# EasyEDA Pro project AcGun-1.0.eprj

# Schematic Schematic1
Create Date: 2023-02-09; Page Name: P1; Project Name: AcGun-1.0; Schematic Name: Schematic1; Update Date: 2023-06-06
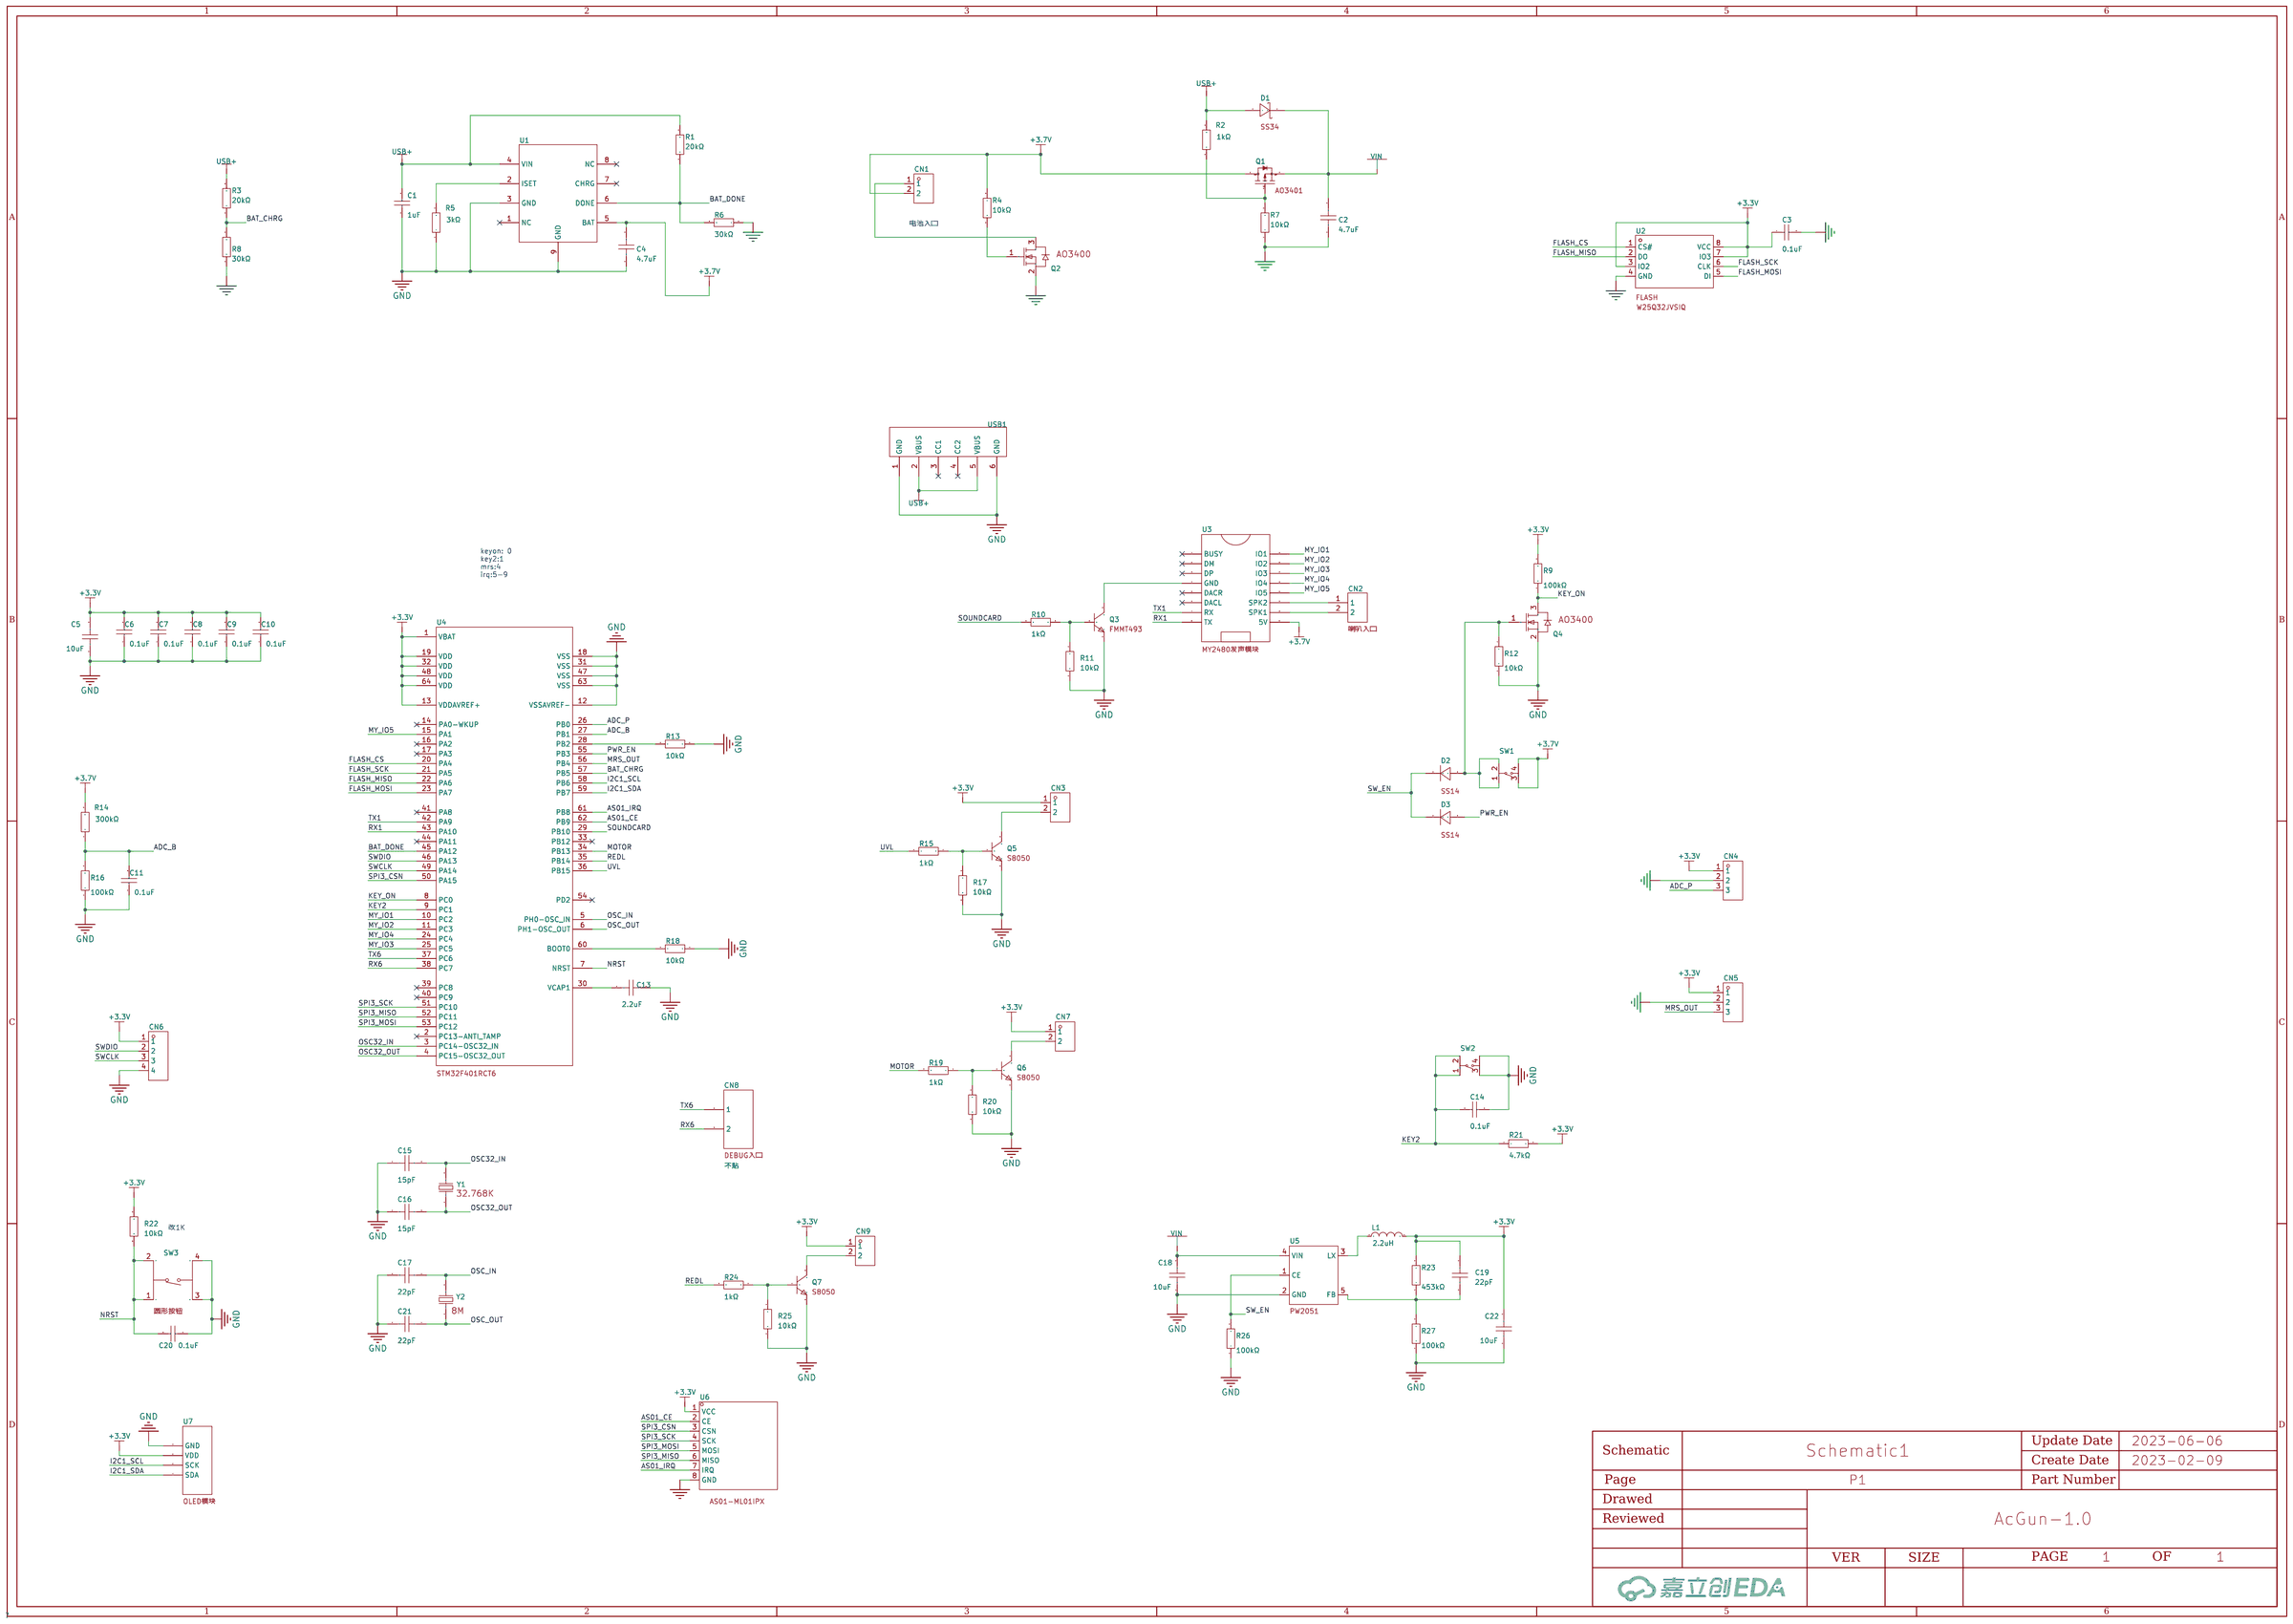
[diagram p0: schematic sheet]

## Parts
C1  1uF  [C0603]
C2  4.7uF  [C0603]
C3  0.1uF  [C0603]
C4  4.7uF  [C0603]
C5  10uF  [C0603]
C6  0.1uF  [C0603]
C7  0.1uF  [C0603]
C8  0.1uF  [C0603]
C9  0.1uF  [C0603]
C10  0.1uF  [C0603]
C11  0.1uF  [C0603]
C13  2.2uF  [C0603]
C14  0.1uF  [C0603]
C15  15pF  [C0603]
C16  15pF  [C0603]
C17  22pF  [C0603]
C18  10uF  [C0603]
C19  22pF  [C0603]
C20  0.1uF  [C0603]
C21  22pF  [C0603]
C22  10uF  [C0603]
CN1  HDGC2501WR-2P  [CONN-TH_2P-P2.50_HDGC2501WR-2P]
CN2  -  [2P接线点]
CN3  HDGC2001WR-2P  [CONN-TH_2P-P2.00_HDGC2001WR-2P]
CN4  HDGC1501WR-3P  [CONN-TH_3P-P1.50_HDGC1501WR-3P]
CN5  HDGC1501WR-3P  [CONN-TH_3P-P1.50_HDGC1501WR-3P]
CN6  1125-1104G0R138C002  [HDR-TH_4P-P2.54-H-M-W9.4]
CN7  HDGC2001WR-2P  [CONN-TH_2P-P2.00_HDGC2001WR-2P]
CN8  不贴  [XH2.54插件2P]  (no BOM)
CN9  HDGC2001WR-2P  [CONN-TH_2P-P2.00_HDGC2001WR-2P]
D1  -  [DO-214AC_L4.3-W2.7-LS5.3-RD]
D2  SS14  [SMA_L4.3-W2.6-LS5.2-RD]
D3  SS14  [SMA_L4.3-W2.6-LS5.2-RD]
L1  2.2uH  [IND-SMD_L4.0-W4.0_0.47UH04209.5A]
Q1  -  [SOT-23-3_L2.9-W1.3-P1.90-LS2.4-BR]
Q2  AO3400  [SOT-23_L2.9-W1.3-P1.90-LS2.4-BR]
Q3  FMMT493  [SOT-23_L2.9-W1.3-P1.90-LS2.4-BR]
Q4  AO3400  [SOT-23_L2.9-W1.3-P1.90-LS2.4-BR]
Q5  S8050  [SOT-23_L2.9-W1.3-P1.90-LS2.4-BR]
Q6  S8050  [SOT-23_L2.9-W1.3-P1.90-LS2.4-BR]
Q7  S8050  [SOT-23_L2.9-W1.3-P1.90-LS2.4-BR]
R1  20kΩ  [R0603]
R2  1kΩ  [R0603]
R3  20kΩ  [R0603]
R4  10kΩ  [R0603]
R5  3kΩ  [R0603]
R6  30kΩ  [R0603]
R7  10kΩ  [R0603]
R8  30kΩ  [R0603]
R9  100kΩ  [R0603]
R10  1kΩ  [R0603]
R11  10kΩ  [R0603]
R12  10kΩ  [R0603]
R13  10kΩ  [R0603]
R14  300kΩ  [R0603]
R15  1kΩ  [R0603]
R16  100kΩ  [R0603]
R17  10kΩ  [R0603]
R18  10kΩ  [R0603]
R19  1kΩ  [R0603]
R20  10kΩ  [R0603]
R21  4.7kΩ  [R0603]
R22  10kΩ  [R0603]
R23  453kΩ  [R0603]
R24  1kΩ  [R0603]
R25  10kΩ  [R0603]
R26  100kΩ  [R0603]
R27  100kΩ  [R0603]
SW1  -  [按钮开关]
SW2  -  [按钮开关]
SW3  1TS001G-2700-1500-CT  [SW-SMD_4P-L5.1-W5.1-P3.70-LS6.5-TL-2]
U1  -  [PW4056]
U2  -  [SOIC-8_L5.3-W5.3-P1.27-LS8.0-BL]
U3  -  [MY2480]
U4  STM32F401RCT6  [LQFP-64_L10.0-W10.0-P0.50-LS12.0-BL]
U5  -  [PW2051]
U6  AS01-ML01IPX  [WIRELM-SMD_8P-L19.0-W12.0-P1.27]
U7  -  [OLED模块封装]
USB1  -  [typec]
Y1  -  [3215]
Y2  -  [5032]

## Library data of the parts
C1 = 0603F105M250NT: 容值:1uF;精度:±20%;额定电压:25V;温度系数:Y5V;; LCSC Part Name: 1uF ±20% 25V; Supplier Part: C36577; Manufacturer: FH(风华); Supplier Footprint: 0603; JLCPCB Part Class: Extended Part; Datasheet: https://atta.szlcsc.com/upload/public/pdf/source/20170923/C36577_1506149443286988738.pdf; Supplier: LCSC; Tolerance: ±20%; Voltage Rated: 25V; Temperature Coefficient: Y5V
C2 C4 = 0603X475M160NT: 容值:4.7uF;精度:±20%;额定电压:16V;温度系数:X5R;; LCSC Part Name: 4.7uF ±20% 16V; Supplier Part: C417282; Manufacturer: FH(风华); Supplier Footprint: 0603; JLCPCB Part Class: Extended Part; Datasheet: https://atta.szlcsc.com/upload/public/pdf/source/20190828/C417282_9FA89336CC150C49D68906F9E844F6E8.pdf; Supplier: LCSC; Tolerance: ±20%; Voltage Rated: 16V; Temperature Coefficient: X5R
C3 C6-C11 C14 C20 = 0603B104K101CT: 容值:100nF;精度:±10%;额定电压:100V;温度系数:X7R;; LCSC Part Name: 100nF ±10% 100V; Supplier Part: C116838; Manufacturer: 华新科(Walsin); Supplier Footprint: 0603; JLCPCB Part Class: Extended Part; Datasheet: https://atta.szlcsc.com/upload/public/pdf/source/20190709/C116838_F1A9F4B47B8E555AD45D8607B90A094B.pdf; Supplier: LCSC; Tolerance: ±10%; Voltage Rated: 100V; Temperature Coefficient: X7R
C5 C18 C22 = 0603X106M100CT: 容值:10uF;精度:±20%;额定电压:10V;温度系数:X5R;; LCSC Part Name: 10uF ±20% 10V; Supplier Part: C89283; Manufacturer: 华新科(Walsin); Supplier Footprint: 0603; JLCPCB Part Class: Extended Part; Datasheet: https://atta.szlcsc.com/upload/public/pdf/source/20161226/1482720147964.pdf; Supplier: LCSC; Tolerance: ±20%; Voltage Rated: 10V; Temperature Coefficient: X5R
C13 = 0603B225K160CT: 容值:2.2uF;精度:±10%;额定电压:16V;温度系数:X7R;; LCSC Part Name: 2.2uF ±10% 16V; Supplier Part: C525501; Manufacturer: 华新科(Walsin); Supplier Footprint: 0603; JLCPCB Part Class: Extended Part; Datasheet: https://atta.szlcsc.com/upload/public/pdf/source/20191217/C469650_84AD5C6F618CF4AC0C6D987F2E8FE6F8.pdf; Supplier: LCSC; Tolerance: ±10%; Voltage Rated: 16V; Temperature Coefficient: X7R
C15 C16 = 0603CG150J500NT: 容值:15pF;精度:±5%;额定电压:50V;温度系数:C0G;; LCSC Part Name: 15pF ±5% 50V; Supplier Part: C91703; Manufacturer: FH(风华); Supplier Footprint: 0603; JLCPCB Part Class: Extended Part; Datasheet: https://atta.szlcsc.com/upload/public/pdf/source/20170105/1483610779016.pdf; Supplier: LCSC; Tolerance: ±5%; Voltage Rated: 50V; Temperature Coefficient: C0G
C17 C19 C21 = 0603CG220F500NT: 容值:22pF;精度:±1%;额定电压:50V;温度系数:C0G;; LCSC Part Name: 22pF ±1% 50V; Supplier Part: C190086; Manufacturer: FH(风华); Supplier Footprint: 0603; JLCPCB Part Class: Extended Part; Datasheet: https://atta.szlcsc.com/upload/public/pdf/source/20180403/C190086_AE2857A36C77ED36CE0DF753AD1C79C3.pdf; Supplier: LCSC; Tolerance: ±1%; Voltage Rated: 50V; Temperature Coefficient: C0G
CN1 = HDGC2501WR-2P: LCSC Part Name: XH2.5弯针 2P; Supplier Part: C5175255; Manufacturer: HDGC(华德共创); Supplier Footprint: 弯插,P=2.5mm; JLCPCB Part Class: Extended Part; Datasheet: https://atta.szlcsc.com/upload/public/pdf/source/20220916/C1717F8E2C78083BF9D63A459D48AEE1.pdf; Supplier: LCSC
CN2 = 2P接线点: 喇叭入口
CN3 CN7 CN9 = HDGC2001WR-2P: LCSC Part Name: PH2.0弯针 2P; Supplier Part: C5175239; Manufacturer: HDGC(华德共创); Supplier Footprint: 弯插,P=2mm; JLCPCB Part Class: Extended Part; Datasheet: https://atta.szlcsc.com/upload/public/pdf/source/20220916/36534CA64A2134C65DEF28B604EC5CCB.pdf; Supplier: LCSC
CN4 CN5 = HDGC1501WR-3P: LCSC Part Name: ZH1.5弯针 3P; Supplier Part: C5175222; Manufacturer: HDGC(华德共创); Supplier Footprint: 弯插,P=1.5mm; JLCPCB Part Class: Extended Part; Datasheet: https://atta.szlcsc.com/upload/public/pdf/source/20220916/4C213ADCC6162123A72E66E7B276D737.pdf; Supplier: LCSC
CN6 = 1125-1104G0R138C002: 排数:单排;总PIN位数:4;间距:2.54mm;插针结构:1x4P;行距:2.54mm;安装类型:弯插;圆针/方针:方针;额定电流:3A;额定电压:320V;配合针长度:6mm;塑高:2.5mm;端接针长度:-;触头材质:黄铜;触头镀层:金;工作温度范围:-40~+105;颜色:黑色;; LCSC Part Name: 2.54mm 1x4P 弯插 方针; Supplier Part: C721443; Manufacturer: Wcon(维峰电子); Supplier Footprint: 弯插,P=2.54mm; JLCPCB Part Class: Extended Part; Datasheet: https://atta.szlcsc.com/upload/public/pdf/source/20200817/C721441_9C294CE567E7CA2BF1A06D224BABC3D8.pdf; Supplier: LCSC; Number of Rows: 单排; Number of Pins: 4; Pitch: 2.54mm; Pin Structure: 1x4P; Row Spacing: 2.54mm; Mounting Type: 弯插; Circluar Pins/Square Pins: 方针; Current Rating (Max): 3A; Voltage Rating (Max): 320V; Length of Mating Pin: 6mm; Insulation Height: 2.5mm; Contact Material: 黄铜; Contact Plating: 金; Operating Temperature Range: -40~+105; Color: 黑色
CN8 = XH2.54插件2P: DEBUG入口
D1 = SS34_C8678: 直流反向耐压(Vr):40V;平均整流电流(Io):3A;正向压降(Vf):550mV@3A;; LCSC Part Name: 40V 3A 550mV@3A; Supplier Part: C8678; Manufacturer: MDD; Manufacturer Part: SS34; Supplier Footprint: SMA(DO-214AC); JLCPCB Part Class: Basic Part; Datasheet: https://atta.szlcsc.com/upload/public/pdf/source/20210506/C15874_5BDBC70F665BA444FCE0210303DB2A89.pdf; Supplier: LCSC; Reverse Voltage (Vr): 40V; Average Rectified Current (Io): 3A; Forward Voltage (Vf@If): 550mV@3A
D2 D3 = SS14A: 直流反向耐压(Vr):40V;平均整流电流(Io):1A;正向压降(Vf):500mV@1A;; LCSC Part Name: 40V 1A 500mV@1A; Supplier Part: C211770; Manufacturer: YANGJIE(扬杰); Supplier Footprint: SMA(DO-214AC); JLCPCB Part Class: Extended Part; Datasheet: https://atta.szlcsc.com/upload/public/pdf/source/20180504/C211770_627C435F34E9C107E4A4301F69D28675.pdf; Supplier: LCSC; Reverse Voltage (Vr): 40V; Average Rectified Current (Io): 1A; Forward Voltage (Vf@If): 500mV@1A
L1 = 2.2uh3a电感: 电感值:2.2uH;精度:±20%;额定电流:3A;直流电阻(DCR):-;; Rated Current: 3A; Supplier: LCSC; Supplier Part: C438930; Supplier Footprint: SMD; LCSC Part Name: 2.2uH ±20% 3A; Tolerance: ±20%; Manufacturer: Cybermax(思博科技); Manufacturer Part: CMLO0420H2R2MTT
Q1 = AO3401_C181091: 类型:P沟道;漏源电压(Vdss):30V;连续漏极电流(Id):4.2A;功率(Pd):350mW;导通电阻(RDS(on)@Vgs,Id):65mΩ@10V,4.2A;阈值电压(Vgs(th)@Id):1.3V@250A;; LCSC Part Name: P沟道 30V 4.2A; Supplier Part: C181091; Manufacturer: Hottech(合科泰); Manufacturer Part: AO3401; Supplier Footprint: SOT-23(SOT-23-3); JLCPCB Part Class: Extended Part; Datasheet: https://atta.szlcsc.com/upload/public/pdf/source/20180131/C181091_15173931948391329220.pdf; Supplier: LCSC; Type: P沟道; Drain Source Voltage (Vdss): 30V; Continuous Drain Current (Id): 4.2A; Power Dissipation (Pd): 350mW; Drain Source On Resistance (RDS(on)@Vgs,Id): 65mΩ@10V,4.2A; Gate Threshold Voltage (Vgs(th)@Id): 1.3V@250A
Q2 Q4 = AO3400: 类型:N沟道;漏源电压(Vdss):30V;连续漏极电流(Id):5.8A;功率(Pd):1.5W;导通电阻(RDS(on)@Vgs,Id):35mΩ@10V,5.8A;阈值电压(Vgs(th)@Id):1.2V@250uA;栅极电荷(Qg@Vgs):-;输入电容(Ciss@Vds):1050pF@15V;反向传输电容(Crss@Vds):77pF@15V;工作温度:+150@(Tj);; LCSC Part Name: N沟道 30V 5.8A; Supplier Part: C2938367; Manufacturer: GOODWORK(固得沃克); Supplier Footprint: SOT23; JLCPCB Part Class: Extended Part; Datasheet: https://atta.szlcsc.com/upload/public/pdf/source/20211229/1DE691E24B5B31BB262C463D0489A9AB.pdf; Supplier: LCSC; Type: N沟道; Drain Source Voltage (Vdss): 30V; Continuous Drain Current (Id): 5.8A; Power Dissipation (Pd): 1.5W; Drain Source On Resistance (RDS(on)@Vgs,Id): 35mΩ@10V,5.8A; Gate Threshold Voltage (Vgs(th)@Id): 1.2V@250uA; Input Capacitance (Ciss@Vds): 1050pF@15V; Reverse Transfer Capacitance (Crss@Vds): 77pF@15V; Operating Temperature: +150@(Tj)
Q3 Q5-Q7 = S8050: 晶体管类型:NPN;集射极击穿电压(Vceo):25V;集电极电流(Ic):500mA;功率(Pd):625mW;集电极-发射极饱和电压(VCE(sat)@Ic,Ib):600mV@500mA,50mA;直流电流增益(hFE@Ic,Vce):200@100mA,1V;特征频率(fT):150MHz;工作温度:+150@(Tj);; LCSC Part Name: NPN 25V 500mA; Supplier Part: C414195; Manufacturer: GP(格瑞宝); Supplier Footprint: SOT-23; JLCPCB Part Class: Extended Part; Datasheet: https://atta.szlcsc.com/upload/public/pdf/source/20190828/C414195_F420B1E456405127F3181AB0586AEC6F.pdf; Supplier: LCSC; Transistor Type: NPN; Collector-Emitter Breakdown Voltage (Vceo): 25V; Collector Current (Ic): 500mA; Power Dissipation (Pd): 625mW; Collector-Emitter Saturation Voltage (VCE(sat)@Ic,Ib): 600mV@500mA,50mA; DC Current Gain (hFE@Ic,Vce): 200@100mA,1V; Transition Frequency (fT): 150MHz; Operating Temperature: +150@(Tj)
R1 R3 = RC0603DR-0720KL: 电阻类型:厚膜电阻;阻值:20kΩ;精度:±0.5%;功率:100mW;温度系数:±100ppm/;最大工作电压:75V;工作温度范围:-55~+155;; LCSC Part Name: 20kΩ ±0.5%; Supplier Part: C137817; Manufacturer: YAGEO(国巨); Supplier Footprint: 0603; JLCPCB Part Class: Extended Part; Datasheet: https://atta.szlcsc.com/upload/public/pdf/source/20171106/C137817_15099606819651093946.pdf; Supplier: LCSC; Type: 厚膜电阻; Tolerance: ±0.5%; Power(Watts): 100mW; Temperature Coefficient: ±100ppm/; Overload Voltage (Max): 75V; Operating Temperature Range: -55~+155
R2 R10 R15 R19 R24 = TR0603B1K00P0525Z: 电阻类型:薄膜电阻;阻值:1kΩ;精度:±0.1%;功率:100mW;温度系数:±25ppm/;最大工作电压:75V;工作温度范围:-55~+155;; LCSC Part Name: 1kΩ ±0.1%; Supplier Part: C188364; Manufacturer: EVER OHMS(天二科技); Supplier Footprint: 0603; JLCPCB Part Class: Extended Part; Datasheet: https://atta.szlcsc.com/upload/public/pdf/source/20190415/C188364_2560310032FA915A7069B8237DA8774F.pdf; Supplier: LCSC; Type: 薄膜电阻; Tolerance: ±0.1%; Power(Watts): 100mW; Temperature Coefficient: ±25ppm/; Overload Voltage (Max): 75V; Operating Temperature Range: -55~+155
R4 R7 R11-R13 R17 R18 R20 R22 R25 = SY0603JN10KP: 阻值:10kΩ;精度:±5%;功率:1/16W;温度系数:±100ppm/;; LCSC Part Name: 10kΩ ±5%; Supplier Part: C380762; Manufacturer: SANYEAR(叁叶源); Supplier Footprint: 0603; JLCPCB Part Class: Extended Part; Datasheet: https://atta.szlcsc.com/upload/public/pdf/source/20190402/C380762_D09B63EB8DF4AE0F44268631C04132BC.pdf; Supplier: LCSC; Tolerance: ±5%; Power(Watts): 1/16W; Temperature Coefficient: ±100ppm/
R5 = 0603WAJ0302T5E: 电阻类型:厚膜电阻;阻值:3kΩ;精度:±5%;功率:1/10W;温度系数:±100ppm/;最大工作电压:75V;工作温度范围:-55~+155;; LCSC Part Name: 3kΩ ±5%; Supplier Part: C25597; Manufacturer: UNI-ROYAL(厚声); Supplier Footprint: 0603; JLCPCB Part Class: Extended Part; Datasheet: https://atta.szlcsc.com/upload/public/pdf/source/20200306/C422600_1E6D84923E4A46A82E41ADD87F860B5C.pdf; Supplier: LCSC; Type: 厚膜电阻; Tolerance: ±5%; Power(Watts): 1/10W; Temperature Coefficient: ±100ppm/; Overload Voltage (Max): 75V; Operating Temperature Range: -55~+155
R6 R8 = AC0603FR-0730KL: 电阻类型:厚膜电阻;阻值:30kΩ;精度:±1%;功率:100mW;温度系数:±100ppm/;最大工作电压:75V;工作温度范围:-55~+155;; LCSC Part Name: 30kΩ ±1%; Supplier Part: C144670; Manufacturer: YAGEO(国巨); Supplier Footprint: 0603; JLCPCB Part Class: Extended Part; Datasheet: https://atta.szlcsc.com/upload/public/pdf/source/20171225/C144670_15141880418861202957.pdf; Supplier: LCSC; Type: 厚膜电阻; Tolerance: ±1%; Power(Watts): 100mW; Temperature Coefficient: ±100ppm/; Overload Voltage (Max): 75V; Operating Temperature Range: -55~+155
R9 R16 R26 R27 = MCT06030C1003FP500: 电阻类型:薄膜电阻;阻值:100kΩ;精度:±1%;功率:100mW;温度系数:±50ppm/K;最大工作电压:75V;工作温度范围:-55~+125;; LCSC Part Name: 100kΩ ±1%; Supplier Part: C161805; Manufacturer: VISHAY(威世); Supplier Footprint: 0603; JLCPCB Part Class: Extended Part; Datasheet: https://atta.szlcsc.com/upload/public/pdf/source/20180125/C161805_15168649470331302834.pdf; Supplier: LCSC; Type: 薄膜电阻; Tolerance: ±1%; Power(Watts): 100mW; Temperature Coefficient: ±50ppm/K; Overload Voltage (Max): 75V; Operating Temperature Range: -55~+125
R14 = RC0603FR-07300KL: 阻值:300kΩ;精度:±1%;功率:100mW;温度系数:±100ppm/;最大工作电压:75V;工作温度范围:-55~+155;; LCSC Part Name: 300kΩ ±1%; Supplier Part: C114667; Manufacturer: YAGEO(国巨); Supplier Footprint: 0603; JLCPCB Part Class: Extended Part; Datasheet: https://atta.szlcsc.com/upload/public/pdf/source/20170818/C114667_1503051153004895128.pdf; Supplier: LCSC; Tolerance: ±1%; Power(Watts): 100mW; Temperature Coefficient: ±100ppm/; Overload Voltage (Max): 75V; Operating Temperature Range: -55~+155
R21 = RMC 0603 4K7 F N: 阻值:4.7kΩ;精度:±1%;功率:0.1W;; LCSC Part Name: 4.7kΩ ±1%; Supplier Part: C269713; Manufacturer: Tyohm(幸亚电阻); Supplier Footprint: 0603; JLCPCB Part Class: Extended Part; Datasheet: https://atta.szlcsc.com/upload/public/pdf/source/20190115/C269713_06B12CBF45628C37C65359B185ED7F9D.pdf; Supplier: LCSC; Tolerance: ±1%; Power(Watts): 0.1W
R23 = 0603WAF4533T5E: 电阻类型:厚膜电阻;阻值:453kΩ;精度:±1%;功率:1/10W;温度系数:±100ppm/;最大工作电压:75V;工作温度范围:-55~+155;; LCSC Part Name: 453kΩ ±1%; Supplier Part: C25818; Manufacturer: UNI-ROYAL(厚声); Supplier Footprint: 0603; JLCPCB Part Class: Extended Part; Datasheet: https://atta.szlcsc.com/upload/public/pdf/source/20200306/C422600_1E6D84923E4A46A82E41ADD87F860B5C.pdf; Supplier: LCSC; Type: 厚膜电阻; Tolerance: ±1%; Power(Watts): 1/10W; Temperature Coefficient: ±100ppm/; Overload Voltage (Max): 75V; Operating Temperature Range: -55~+155
SW1 SW2 = 按键开关
SW3 = 1TS001G-2700-1500-CT: 触点电流:20mA;额定电压(DC):12V;电路结构:单刀单掷;安装方式:立贴;按钮形状:圆形按钮;带灯:-;开关长度:5.1mm;开关宽度:5.1mm;开关高度:0.3mm;; LCSC Part Name: 铜头按钮; Supplier Part: C318800; Manufacturer: HYP(鸿源精密); Supplier Footprint: SMD,5.1x5.1mm; JLCPCB Part Class: Extended Part; Datasheet: https://atta.szlcsc.com/upload/public/pdf/source/20200109/C318800_E3EE45BECD3EEEC6701309AC007B685B.pdf; Supplier: LCSC; Contact Current: 20mA; Voltage Rating (DC): 12V; Circuit: 单刀单掷; Mounting Style: 立贴; Actuator Style: 圆形按钮; Switch Length: 5.1mm; Switch Width: 5.1mm; Switch Height: 0.3mm
U1 = PW4056: 带OVP充电芯片
U2 = W25Q128JVSIQ: 存储器类型:Non-Volatile;存储器构架(格式):FLASH;存储器容量:128Mb (16M x 8);存储器接口类型:SPI - Dual/Quad I/O;; LCSC Part Name: W25Q32JVSIQ; Supplier Part: C97521; Manufacturer: WINBOND(华邦); Supplier Footprint: SOIC-8_208mil; JLCPCB Part Class: Basic Part; Datasheet: https://atta.szlcsc.com/upload/public/pdf/source/20170316/1489627409956.pdf; Supplier: LCSC; Memory Type: Non-Volatile; Memory Format: FLASH; Memory Size: 128Mb (16M x 8); Memory Interface: SPI - Dual/Quad I/O; Voltage - Supply: 2.7V ~ 3.6V
U3 = MY2480: MY2480发声模块
U4 = STM32F401RCT6: 主频（MAX):84MHz;工作电压:1.7V ~ 3.6V;; Supplier Part: C74524; Manufacturer: ST(意法半导体); Supplier Footprint: LQFP-64_10x10x05P; JLCPCB Part Class: Extended Part; Datasheet: https://atta.szlcsc.com/upload/public/pdf/source/20170728/C74524_1501225886278849063.pdf; Supplier: LCSC; Speed: 84MHz; Voltage - Supply (Vcc/Vdd): 1.7V ~ 3.6V; Program Memory Size: 256KB; RAM Size: 64KB; Number of I/O: 50; A/D: 16x12bit; PWM: 32; UART/USART: 3 USART; SPI: 3; I2C（SMBUS/PMBUS）: 2; USB Device: 1; USB Host/OTG: 1
U5 = PW2051: Supplier: LCSC; Supplier Part: C9900004763; Supplier Footprint: SOT23-5; JLCPCB Part Class: Extended Part; Datasheet: 2021-12-24/856123Z/fbe1facec1e64a42b88c21fe7c936e8d/PW2051.pdf
U6 = AS01-ML01IPX: NRF24L01P无线模块 SPI通信; Supplier Part: C89508; Manufacturer: Ashining(泽耀科技); Supplier Footprint: SMD; JLCPCB Part Class: Extended Part; Datasheet: https://atta.szlcsc.com/upload/public/pdf/source/20180423/C89508_2FC7CA24D6819A879B6CB40B1DC4CAA0.pdf; Supplier: LCSC
U7 = 长型OLED屏幕: OLED模块
USB1 = typec
Y1 = 32.768KHz晶振: Frequency: 32.768K
Y2 = 8MHz晶振: Capacitance: 8M

## Nets
+3.3V: C3.1 C5.2 C6.2 C7.2 C8.2 C9.2 C10.2 C19.1 C22.2 CN3.1 CN4.1 CN5.1 CN6.1 CN7.1 CN9.1 L1.2 R9.2 R21.2 R22.1 R23.2 U2.3(IO2) U2.7(IO3) U2.8(VCC) U4.1(VBAT) U4.13(VDDAVREF+) U4.19(VDD) U4.32(VDD) U4.48(VDD) U4.64(VDD) U6.1(VCC) U7.2(VDD)
+3.7V: C4.2 CN1.2 Q1.3(D) R4.2 R14.2 SW1.3(C) SW1.4(D) U1.5(BAT) U3.9(5V)
GND: C1.1 C2.1 C3.2 C4.1 C5.1 C6.1 C7.1 C8.1 C9.1 C10.1 C11.1 C13.2 C14.1 C15.1 C16.1 C17.2 C18.1 C20.1 C21.2 C22.1 CN4.2 CN5.2 CN6.4 Q2.2(S) Q3.2(E) Q4.2(S) Q5.2(E) Q6.2(E) Q7.2(E) R5.1 R6.1 R7.1 R8.1 R11.2 R12.2 R13.1 R16.1 R17.2 R18.1 R20.2 R25.2 R26.1 R27.1 SW2.3(C) SW2.4(D) SW3.3(C) SW3.4(D) U1.3(GND) U1.9(GND) U2.4(GND) U4.12(VSSAVREF-) U4.18(VSS) U4.31(VSS) U4.47(VSS) U4.63(VSS) U5.2(GND) U6.8(GND) U7.1(GND) USB1.1(GND) USB1.6(GND)
VIN: C2.2 C18.2 D1.1(K) Q1.2(S) U5.4(VIN)
ADC_B: C11.2 R14.1 R16.2 U4.27(PB1)
ADC_P: CN4.3 U4.26(PB0)
AS01_CE: U4.62(PB9) U6.2(CE)
AS01_IRQ: U4.61(PB8) U6.7(IRQ)
BAT_CHRG: R3.1 R8.2 U4.57(PB5)
BAT_DONE: R1.1 R6.2 U1.6(DONE) U4.45(PA12)
FLASH_CS: U2.1(CS#) U4.20(PA4)
FLASH_MISO: U2.2(DO) U4.22(PA6)
FLASH_MOSI: U2.5(DI) U4.23(PA7)
FLASH_SCK: U2.6(CLK) U4.21(PA5)
I2C1_SCL: U4.58(PB6) U7.3(SCK)
I2C1_SDA: U4.59(PB7) U7.4(SDA)
KEY2: C14.2 R21.1 SW2.1(A) SW2.2(B) U4.9(PC1)
KEY_ON: Q4.3(D) R9.1 U4.8(PC0)
MOTOR: R19.2 U4.34(PB13)
MRS_OUT: CN5.3 U4.56(PB4)
MY_IO1: U3.16(IO1) U4.10(PC2)
MY_IO2: U3.15(IO2) U4.11(PC3)
MY_IO3: U3.14(IO3) U4.25(PC5)
MY_IO4: U3.13(IO4) U4.24(PC4)
MY_IO5: U3.12(IO5) U4.15(PA1)
NRST: C20.2 R22.2 SW3.1(A) SW3.2(B) U4.7(NRST)
OSC32_IN: C15.2 U4.3(PC14-OSC32_IN) Y1.2
OSC32_OUT: C16.2 U4.4(PC15-OSC32_OUT) Y1.1
OSC_IN: C17.1 U4.5(PH0-OSC_IN) Y2.2
OSC_OUT: C21.1 U4.6(PH1-OSC_OUT) Y2.1
PWR_EN: D3.2(A) U4.55(PB3)
REDL: R24.2 U4.35(PB14)
RX1: U3.8(TX) U4.43(PA10)
RX6: CN8.2 U4.38(PC7)
SOUNDCARD: R10.2 U4.29(PB10)
SPI3_CSN: U4.50(PA15) U6.3(CSN)
SPI3_MISO: U4.52(PC11) U6.6(MISO)
SPI3_MOSI: U4.53(PC12) U6.5(MOSI)
SPI3_SCK: U4.51(PC10) U6.4(SCK)
SW_EN: D2.1(C) D3.1(C) R26.2 U5.1(CE)
SWCLK: CN6.3 U4.49(PA14)
SWDIO: CN6.2 U4.46(PA13)
TX1: U3.7(RX) U4.42(PA9)
TX6: CN8.1 U4.37(PC6)
USB+: C1.2 D1.2(A) R1.2 R2.2 R3.2 U1.4(VIN) USB1.2(VBUS) USB1.5(VBUS)
UVL: R15.2 U4.36(PB15)
$1N1304: C13.1 U4.30(VCAP1)
$1N1668: R18.2 U4.60(BOOT0)
$1N1829: R13.2 U4.28(PB2)
$1N9984: CN9.2 Q7.3(C)
$1N10713: Q7.1(B) R24.1 R25.1
$1N11694: CN7.2 Q6.3(C)
$1N11697: Q6.1(B) R19.1 R20.1
$1N15476: L1.1 U5.3(LX)
$1N15617: C19.2 R23.1 R27.2 U5.5(FB)
$1N23471: D2.2(A) Q4.1(G) R12.1 SW1.1(A) SW1.2(B)
$1N28745: Q3.1(B) R10.1 R11.1
$1N30076: Q3.3(C) U3.4(GND)
$1N30362: CN2.1 U3.11(SPK2)
$1N30425: CN2.2 U3.10(SPK1)
$1N40650: R5.2 U1.2(ISET)
$1N44119: CN1.1 Q2.3(D)
$1N77249: Q2.1(G) R4.1
$1N80171: Q1.1(G) R2.1 R7.2
$1N140145: Q5.1(B) R15.1 R17.1
$1N144140: CN3.2 Q5.3(C)

Not connected (* = marked no-connect by the designer): U1 1(NC)* 7(CHRG)* 8(NC)*; U3 1(BUSY)* 2(DM)* 3(DP)* 5(DACR)* 6(DACL)*; U4 2(PC13-ANTI_TAMP)* 14(PA0-WKUP)* 16(PA2)* 17(PA3)* 33(PB12)* 39(PC8)* 40(PC9)* 41(PA8)* 44(PA11)* 54(PD2)*; USB1 3(CC1)* 4(CC2)*

## Notes on the sheet
- 电池入口
- keyon: 0
  key2:1
  mrs:4
  irq:5-9
- 改1K

# Board PCB1
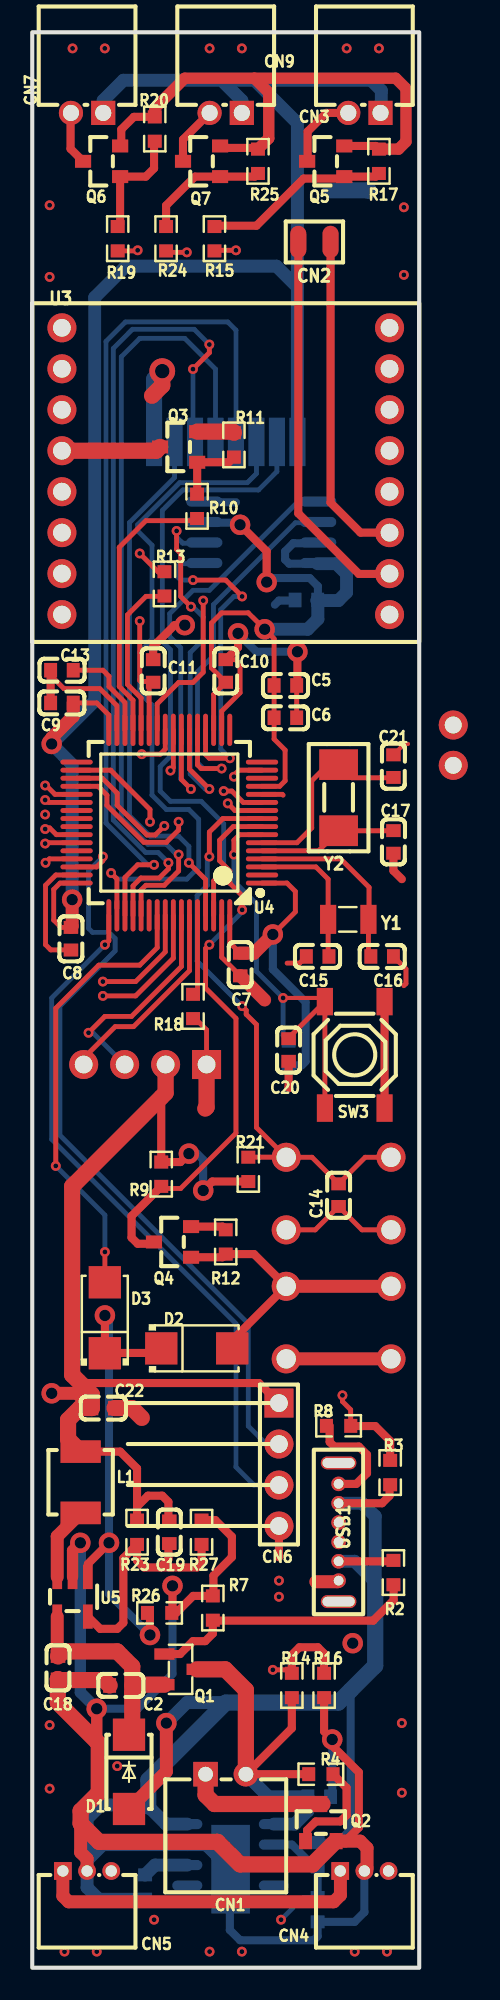
[diagram p1: board, top side]
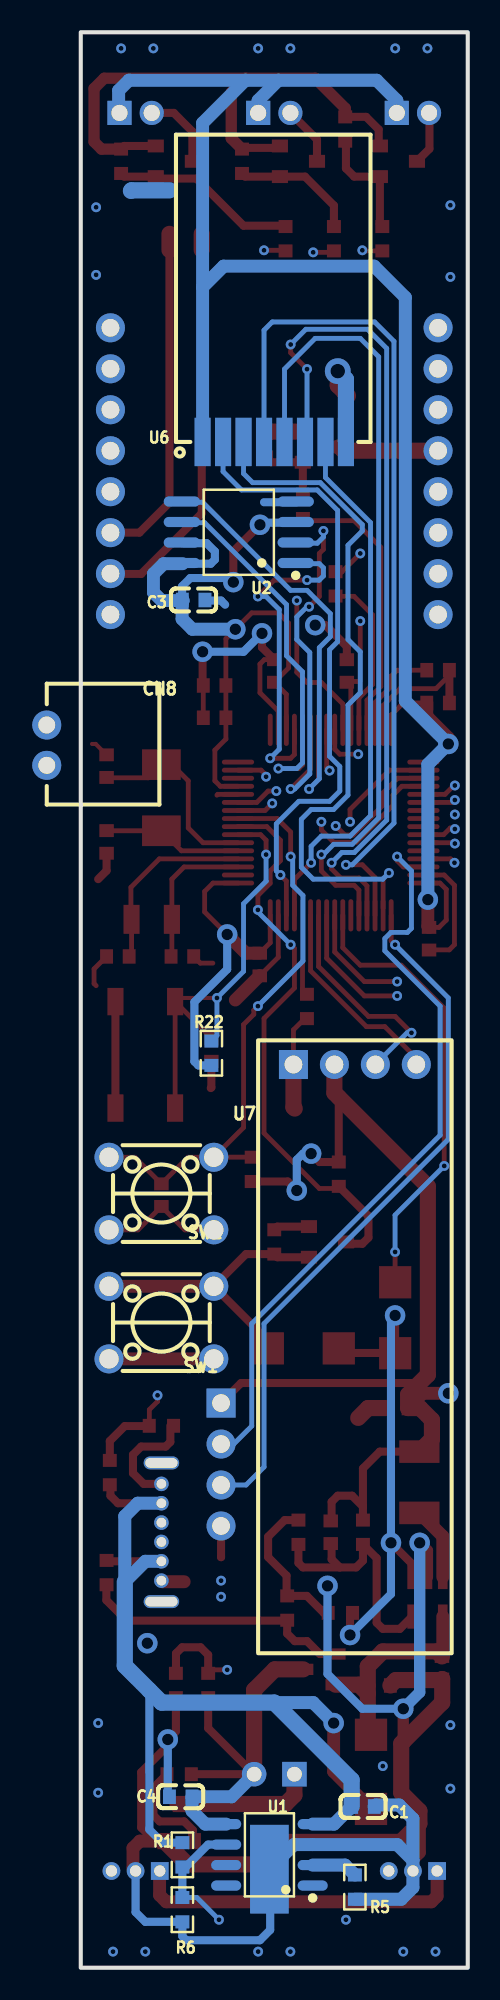
[diagram p2: board, bottom side, seen from below]

Outline 24 x 120 mm; copper layers: Top Layer, CPU1, CPU2, Bottom Layer. Coordinates in mm from the lower left corner of the outline.
Outline path: rectangle 0,120 24,0
Stack: Top Layer 0.035mm / Dielectric1 0.48mm PP er 4.5 / CPU1 0.035mm / Dielectric2 0.48mm FR4 er 4.5 / CPU2 0.035mm / Dielectric3 0.48mm PP er 4.5 / Bottom Layer 0.035mm

## Design rules (mm)
spacing safeClearance (default): track to track 0.152, other pairs 0.152 to 0.3
track width trackWidth (default): min 0.127, default 0.254, max 2.54
differential pair differentialPair (default): width min 0.127, default 0.254, max 2.54; gap min 0.152, default 0.152
via viaSize (default): diameter min 0.5, default 0.61, max 10; hole min 0.3, default 0.305, max 6

## Placement (name value [footprint] x y rotation side)
C1  1uF  [C0603]  6.5 10 0 bottom
C2  4.7uF  [C0603]  5.5 17.5 0 top
C3  0.1uF  [C0603]  17 84.8 180 bottom
C4  4.7uF  [C0603]  17.8 10.6 180 bottom
C5  10uF  [C0603]  15.7 79.5 180 top
C6  0.1uF  [C0603]  15.7 77.5 180 top
C7  0.1uF  [C0603]  12.9 62.2 90 top
C8  0.1uF  [C0603]  2.4 63.8 90 top
C9  0.1uF  [C0603]  1.84 78.42 0 top
C10  0.1uF  [C0603]  12 80.4 270 top
C11  0.1uF  [C0603]  7.5 80.4 270 top
C13  2.2uF  [C0603]  1.84 80.45 180 top
C14  0.1uF  [C0603]  19 47.9 90 top
C15  15pF  [C0603]  17.7 62.7 0 top
C16  15pF  [C0603]  21.7 62.7 180 top
C17  22pF  [C0603]  22.4 69.8 270 top
C18  10uF  [C0603]  1.6 18.6 90 top
C19  22pF  [C0603]  8.5 27 270 top
C20  0.1uF  [C0603]  15.9 56.9 90 top
C21  22pF  [C0603]  22.4 74.5 90 top
C22  10uF  [C0603]  4.4 34.7 180 top
CN1  HDGC2501WR-2P  [CONN-TH_2P-P2.50_HDGC2501WR-2P]  12 12 0 top
CN2  -  [2P接线点]  17.5 107 180 top
CN3  HDGC2001WR-2P  [CONN-TH_2P-P2.00_HDGC2001WR-2P]  20.6 115 180 top
CN4  HDGC1501WR-3P  [CONN-TH_3P-P1.50_HDGC1501WR-3P]  20.6 6 0 top
CN5  HDGC1501WR-3P  [CONN-TH_3P-P1.50_HDGC1501WR-3P]  3.4 6 0 top
CN6  1125-1104G0R138C002  [HDR-TH_4P-P2.54-H-M-W9.4]  15.3 31.2 270 top
CN7  HDGC2001WR-2P  [CONN-TH_2P-P2.00_HDGC2001WR-2P]  3.4 115 180 top
CN8  不贴  [XH2.54插件2P]  22.3 75.8 90 bottom
CN9  HDGC2001WR-2P  [CONN-TH_2P-P2.00_HDGC2001WR-2P]  12 115 180 top
D1  -  [DO-214AC_L4.3-W2.7-LS5.3-RD]  6 12.15 270 top
D2  SS14  [SMA_L4.3-W2.6-LS5.2-RD]  10.2 38.4 0 top
D3  SS14  [SMA_L4.3-W2.6-LS5.2-RD]  4.5 40.3 90 top
L1  2.2uH  [IND-SMD_L4.0-W4.0_0.47UH04209.5A]  3 30.1 90 top
Q1  -  [SOT-23-3_L2.9-W1.3-P1.90-LS2.4-BR]  9.2 18.5 180 top
Q2  AO3400  [SOT-23_L2.9-W1.3-P1.90-LS2.4-BR]  17.9 9 270 top
Q3  FMMT493  [SOT-23_L2.9-W1.3-P1.90-LS2.4-BR]  9.08 94.29 0 top
Q4  AO3400  [SOT-23_L2.9-W1.3-P1.90-LS2.4-BR]  8.7 45 0 top
Q5  S8050  [SOT-23_L2.9-W1.3-P1.90-LS2.4-BR]  18.2 112 0 top
Q6  S8050  [SOT-23_L2.9-W1.3-P1.90-LS2.4-BR]  4.3 112 0 top
Q7  S8050  [SOT-23_L2.9-W1.3-P1.90-LS2.4-BR]  10.5 112 0 top
R1  20kΩ  [R0603]  17.7 7 90 bottom
R2  1kΩ  [R0603]  22.4 24.5 90 top
R3  20kΩ  [R0603]  22.2 30.7 270 top
R4  10kΩ  [R0603]  17.9 12 180 top
R5  3kΩ  [R0603]  7 5 90 bottom
R6  30kΩ  [R0603]  17.7 3.6 90 bottom
R7  10kΩ  [R0603]  11.2 22.3 270 top
R8  30kΩ  [R0603]  19 33.6 0 top
R9  100kΩ  [R0603]  8 49.2 90 top
R10  1kΩ  [R0603]  10.22 90.61 270 top
R11  10kΩ  [R0603]  12.51 94.42 90 top
R12  10kΩ  [R0603]  12 45 90 top
R13  10kΩ  [R0603]  8.2 85.8 270 top
R14  300kΩ  [R0603]  16.1 17.5 270 top
R15  1kΩ  [R0603]  11.3 107.2 270 top
R16  100kΩ  [R0603]  18.1 17.5 90 top
R17  10kΩ  [R0603]  21.5 112 90 top
R18  10kΩ  [R0603]  9.97 59.6 90 top
R19  1kΩ  [R0603]  5.3 107.2 270 top
R20  10kΩ  [R0603]  7.6 114 90 top
R21  4.7kΩ  [R0603]  13.4 49.5 270 top
R22  10kΩ  [R0603]  15.9 56.7 90 bottom
R23  453kΩ  [R0603]  6.5 27 90 top
R24  1kΩ  [R0603]  8.3 107.2 270 top
R25  10kΩ  [R0603]  14 112 90 top
R26  100kΩ  [R0603]  7.9 22 180 top
R27  100kΩ  [R0603]  10.5 27 270 top
SW1  -  [按钮开关]  19 40 180 bottom
SW2  -  [按钮开关]  19 48 180 bottom
SW3  1TS001G-2700-1500-CT  [SW-SMD_4P-L5.1-W5.1-P3.70-LS6.5-TL-2]  20 56.6 90 top
U1  -  [PW4056]  12.3 7 90 bottom
U2  -  [SOIC-8_L5.3-W5.3-P1.27-LS8.0-BL]  14.2 89 90 bottom
U3  -  [MY2480]  12 103.2 0 top
U4  STM32F401RCT6  [LQFP-64_L10.0-W10.0-P0.50-LS12.0-BL]  8.5 71 90 top
U5  -  [PW2051]  2.5 23 90 top
U6  AS01-ML01IPX  [WIRELM-SMD_8P-L19.0-W12.0-P1.27]  12 94.6 180 bottom
U7  -  [OLED模块封装]  13 57.5 180 bottom
USB1  -  [typec]  19 27 90 top
Y1  -  [3215]  19.6 65 180 top
Y2  -  [5032]  19 72.5 270 top

## Footprints (pads in the part's own frame, mm; a bottom-side part is the same pattern mirrored in y, then rotated)
2P接线点
  oval 1x2 smd: 1(-1,0) 2(1,0)
3215
  rect 1x1.8 smd: 1(-1.25,0) 2(1.25,0)
5032
  rect 1.9x2.401 smd: 1(-2.093,0) 2(2.007,0)
C0603
  rect 0.8x0.899 smd: 1(-0.701,0) 2(0.701,0)
CONN-TH_2P-P2.00_HDGC2001WR-2P
  rect 1.5x1.5 hole 1: 1(-1,0)
  round 1.5 hole 1: 2(1,0)
CONN-TH_2P-P2.50_HDGC2501WR-2P
  rect 1.524x1.524 hole 0.914: 1(-1.25,0)
  round 1.524 hole 0.914: 2(1.25,0)
CONN-TH_3P-P1.50_HDGC1501WR-3P
  rect 1.1x1.1 hole 0.7: 1(-1.5,0)
  round 1.1 hole 0.7: 2(0,0) 3(1.5,0)
DO-214AC_L4.3-W2.7-LS5.3-RD
  rect 1.999x1.999 smd: 1(-2.299,0) 2(2.301,0)
HDR-TH_4P-P2.54-H-M-W9.4
  rect 1.8x1.8 hole 1.1: 1(-3.81,0)
  round 1.8 hole 1.1: 2(-1.27,0) 3(1.27,0) 4(3.81,0)
IND-SMD_L4.0-W4.0_0.47UH04209.5A
  rect 1.399x2.499 smd: 1(-1.9,0) 2(1.9,0)
LQFP-64_L10.0-W10.0-P0.50-LS12.0-BL
  oval 0.3x2 smd: 1(-3.75,-5.75) 2(-3.25,-5.75) 3(-2.75,-5.75) 4(-2.25,-5.75) 5(-1.75,-5.75) 6(-1.25,-5.75) 7(-0.75,-5.75) 8(-0.25,-5.75) 9(0.25,-5.75) 10(0.75,-5.75) 11(1.25,-5.75) 12(1.75,-5.75) 13(2.25,-5.75) 14(2.75,-5.75) 15(3.25,-5.75) 16(3.75,-5.75) 33(3.75,5.75) 34(3.25,5.75) 35(2.75,5.75) 36(2.25,5.75) 37(1.75,5.75) 38(1.25,5.75) 39(0.75,5.75) 40(0.25,5.75) 41(-0.25,5.75) 42(-0.75,5.75) 43(-1.25,5.75) 44(-1.75,5.75) 45(-2.25,5.75) 46(-2.75,5.75) 47(-3.25,5.75) 48(-3.75,5.75)
  oval 2x0.3 smd: 17(5.75,-3.75) 18(5.75,-3.25) 19(5.75,-2.75) 20(5.75,-2.25) 21(5.75,-1.75) 22(5.75,-1.25) 23(5.75,-0.75) 24(5.75,-0.25) 25(5.75,0.25) 26(5.75,0.75) 27(5.75,1.25) 28(5.75,1.75) 29(5.75,2.25) 30(5.75,2.75) 31(5.75,3.25) 32(5.75,3.75) 49(-5.75,3.75) 50(-5.75,3.25) 51(-5.75,2.75) 52(-5.75,2.25) 53(-5.75,1.75) 54(-5.75,1.25) 55(-5.75,0.75) 56(-5.75,0.25) 57(-5.75,-0.25) 58(-5.75,-0.75) 59(-5.75,-1.25) 60(-5.75,-1.75) 61(-5.75,-2.25) 62(-5.75,-2.75) 63(-5.75,-3.25) 64(-5.75,-3.75)
MY2480
  round 1.8 hole 1.1: 1(-10.16,-1.524) 2(-10.16,-4.064) 3(-10.16,-6.604) 4(-10.16,-9.144) 5(-10.16,-11.684) 6(-10.16,-14.224) 7(-10.16,-16.764) 8(-10.16,-19.304) 9(10.16,-19.304) 10(10.16,-16.764) 11(10.16,-14.224) 12(10.16,-11.684) 13(10.16,-9.144) 14(10.16,-6.604) 15(10.16,-4.064) 16(10.16,-1.524)
OLED模块封装
  rect 1.8x1.8 hole 1.1: 1(2.19,-1.5)
  round 1.8 hole 1.1: 2(4.73,-1.5) 3(7.27,-1.5) 4(9.81,-1.5)
PW2051
  rect 1.5x0.6 smd: 1(1.227,-0.95) 2(1.227,0) 3(1.227,0.95) 4(-1.227,0.95) 5(-1.227,-0.95)
PW4056
  oval 0.63x1.865 smd: 1(-1.905,-2.683) 2(-0.635,-2.683) 3(0.635,-2.683) 4(1.905,-2.683) 5(1.905,2.683) 6(0.635,2.683) 7(-0.635,2.683) 8(-1.905,2.683)
  rect 5.5x2.4 smd: 9(-0.889,0)
R0603
  rect 0.807x0.864 smd: 1(-0.754,0) 2(0.754,0)
SMA_L4.3-W2.6-LS5.2-RD
  rect 2x2 smd: 1(-2.2,0) 2(2.2,0)
SOIC-8_L5.3-W5.3-P1.27-LS8.0-BL
  oval 0.63x2.251 smd: 1(-1.905,-3.53) 2(-0.635,-3.53) 3(0.635,-3.53) 4(1.905,-3.53) 5(1.905,3.53) 6(0.635,3.53) 7(-0.635,3.53) 8(-1.905,3.53)
SOT-23-3_L2.9-W1.3-P1.90-LS2.4-BR
  rect 1.25x0.701 smd: 1(1.001,-0.95) 2(1.001,0.95) 3(-1.001,0)
SOT-23_L2.9-W1.3-P1.90-LS2.4-BR
  rect 1x0.8 smd: 1(1.15,-0.95) 2(1.15,0.95) 3(-1.15,0)
SW-SMD_4P-L5.1-W5.1-P3.70-LS6.5-TL-2
  rect 1.7x1 smd: 1(-3.3,1.849) 2(3.3,1.851) 3(-3.3,-1.851) 4(3.3,-1.851)
typec
  round 0.9 hole 0.6: 1(-3,0) 2(-1.8,0) 3(-0.6,0) 4(0.6,0) 5(1.8,0) 6(3,0)
  oval 0.8x2.2 hole 0.6x2: 7(-4.3,0) 8(4.3,0)
WIRELM-SMD_8P-L19.0-W12.0-P1.27
  rect 1x3 smd: 1(-4.445,0) 2(-3.175,0) 3(-1.905,0) 4(-0.635,0) 5(0.635,0) 6(1.905,0) 7(3.175,0) 8(4.445,0)
XH2.54插件2P
  round 1.8 hole 1.05: 1(1.25,3.81) 2(-1.25,3.81)
按钮开关
  round 1.8 hole 1.2: 1(-3.25,2.25) 2(3.25,2.25) 3(-3.25,-2.25) 4(3.25,-2.25)

## Nets
As in the schematic.

Pads without a net: U1 1 7 8; U3 1 2 3 5 6; U4 2 14 16 17 33 39 40 41 44 54; USB1 3 4 7 8

## Via types
v1: diameter 1.27, hole 0.711, Top Layer to Bottom Layer, 21 vias
v2: diameter 0.61, hole 0.305, Top Layer to Bottom Layer, 76 vias
v3: diameter 1.6, hole 0.9, Top Layer to Bottom Layer, 1 via

## Routing (per net, layer and track width the routed paths; a pad name or vN(x,y) marks a point on that pad's centre or on a via; arc(x,y) is an arc through that point)
+3.3V: length 353.6
  Top Layer w0.3: C9.2 4,78.42 4.75,77.66 U4.32 ; 12.9,62.9 12.25,63.55 U4.64 ; v1(14.92,64.06) 16.32,65.46 16.32,66.73 15.8,67.25 U4.1 ; U4.13 15.34,73.25 15.68,73.59 15.68,75.49 15,76.18 C6.2 C5.2 15,82.4 v1(14.41,82.99) 13.4,84 11.75,84 11.11,83.37 11.11,80.59 12,79.7 11.25,78.95 U4.19 ; U4.48 1.72,67.25 1.33,66.86 1.33,64.95 1.78,64.5 C8.2
  Top Layer w0.5: v1(14.54,85.91) 14.54,87.81 v1(12.89,89.46) ; v1(10.6,48.19) 11.16,48.75 R21.2 ; R23.2 6.5,28.59 ; 6.5,28.59 7.17,29.27 8.06,29.27 8.44,28.88 8.44,27.76 C19.1 ; 6.5,28.59 6.5,30.96 5.46,32 L1.2 ; v1(9.71,50.48) 9.19,49.95 R9.2 8,53.97 ; 3.17,36.06 3.36,36.25 14.06,36.25 CN6.1 ; 3.87,34.87 3.7,34.7
  Top Layer w0.8: 3.7,34.7 2.78,35.62 v1(1.2,35.62) ; C9.2 2.54,77.59 1.2,76.26 v1(1.2,75.88) ; 12.9,62.9 13.76,62.9 v1(14.92,64.06) ; CN5.1 1.9,4.44 2.25,4.09 18.7,4.09 19.11,4.5 19.11,5.99 CN4.1 ; C8.2 2.47,64.58 v1(2.47,66.22)
  Top Layer w1: L1.2 2.22,32.78 2.22,33.97 2.96,34.7 3.7,34.7 3.7,35.53 2.47,36.76 2.47,48.44 8.27,54.24 U7.2
  CPU1 w0.8: v1(14.92,64.06) 14.92,63.18 14.41,62.67 14.41,55.43 12.89,53.9 8.95,53.9 8.27,54.59 U7.2 ; v1(1.2,35.62) 1.2,21.52 2.73,20 2.73,15.42 4.25,13.9 4.25,10.72 1.9,8.37 CN5.1
  CPU2 w0.8: U7.2 5.03,59.24 3.62,59.24 1.08,61.78 1.08,65.21 2.09,66.22 v1(2.47,66.22) ; v1(14.41,82.99) 14.41,81.78 13.78,81.15 13.78,77.02 16.57,74.22 16.57,65.72 v1(14.92,64.06)
  Bottom Layer w0.5: 17.65,84.77 17.72,84.83 17.72,85.65 17.21,86.16 14.79,86.16 v1(14.54,85.91) ; v1(9.71,50.48) 10.22,50.48 10.6,50.09 v1(10.6,48.19) ; 17.69,88.32 16.19,88.32 15.68,87.81 15.68,87.31 15.94,87.05 17.69,87.05 ; 10.63,89.59 12.76,89.59 v1(12.89,89.46) ; R22.1 16.71,55.95 16.95,56.19 16.95,59.87 14.92,61.91 v1(14.92,64.06)
  Bottom Layer w0.8: 16.44,104.2 16.44,114.37 13.79,117.02 ; 16.44,104.2 15.14,105.5 5.81,105.5 3.87,103.56 3.87,78.54 v1(1.2,75.88) 2.47,74.61 v1(2.47,66.22) ; 16.44,104.2 U6.1 ; 13.79,117.02 11.75,117.02 ; 13.79,117.02 21.02,117.02 21.65,116.39 21.65,115.03 21.62,115 ; 11.75,117.02 5.65,117.02 4.4,115.78 CN7.1 ; 11.75,117.02 13,115.77 CN9.1 ; v1(14.41,82.99) 17.08,82.99 17.72,83.62 17.72,84.7 17.65,84.77 18.98,84.77 19.49,85.27 19.49,86.42 18.86,87.05 17.69,87.05
+3.7V: length 135.6
  Top Layer w0.5: R14.2 16.1,14.85 CN1.2 R4.2
  Top Layer w0.8: SW1.3 SW1.4
  Top Layer w1: CN1.2 13.25,17.22 11.97,18.5 Q1.3
  CPU1 w0.5: 13.78,19.61 13.65,19.74 13.65,36.38 15.02,37.75 SW1.4
  CPU1 w1: CN1.2 13.78,12.53 13.78,19.61 14.67,20.5 19.49,20.5 v1(19.87,20.12)
  CPU2 w1: v1(19.87,20.12) 20.96,21.21 20.96,35.93 18.6,38.28 18.6,44.25 17.59,45.27 17.59,49.71 19.62,51.75 19.62,66.98 21.02,68.38 21.02,76.13 19.49,77.65 19.49,81.23 U3.9
  Bottom Layer w0.8: U1.5 16.28,8.91 17.1,9.73 C4.2 14.65,10.6 CN1.2
GND: length 273.3
  Top Layer w0.254: 23.3,75.88 23.07,75.88 22.4,75.2
  Top Layer w0.3: C7.1 11.75,62.65 U4.63 ; 23.05,60.89 23.18,61.02 23.18,61.93 C16.1 ; 2.4,63.1 2.39,63.11 1.14,63.11 0.82,63.43 0.82,67.11 1.46,67.75 U4.47 ; SW2.4 17.55,45.75 19,47.2 20.45,45.75 SW2.3 ; v2(6.67,87.69) 7.82,86.54 8.19,86.54 ; U7.1 10.81,58.15 10.09,58.86 ; U4.12 15.51,72.75 15.56,72.7 ; C10.1 12.62,81.1 12.89,80.83 12.89,79.05 11.75,77.91 U4.18 ; U4.31 5.25,78.25 4.2,79.3 1.97,79.3 1.14,80.13 ; C5.1 C6.1 ; 15.81,62.29 16.59,62.29 C15.1
  Top Layer w0.5: C10.1 12.76,81.86 v1(12.76,82.73) ; C11.1 7.5,81.92 8.82,83.24 v1(9.46,83.24) ; Q7.2 11.77,112.83 13.92,112.83 R25.2 ; 19.41,7.85 20.25,8.69 20.25,12.12 18.6,13.77 v1(18.6,14.15) 18.1,14.66 R16.1 ; CN6.4 15.3,25.46 15.3,25.46 ; 22.92,67.49 22.4,68.02 22.4,69.1 ; v1(8.7,23.68) 8.7,22.04 R26.1 8.92,22 9.98,23.05 R7.1 11.24,23.09 11.24,24.31 12.38,25.46 12.38,26.73 11.35,27.75 R27.1 ; C13.2 C9.1 ; R12.2 11.8,45.95 Q4.2 ; 18.45,33.6 18.45,32.6 18.73,32.31 20.25,32.31 20.76,31.81 20.76,30.66 20.1,30 USB1.6 ; R20.2 6.3,114.75 5.52,113.97 5.52,113.02 Q6.2 ; 15.94,54.54 15.9,54.58 15.9,56.2 ; C5.1 16.44,79.54 v1(16.44,81.59) ; SW3.4 SW3.3 ; Q5.2 21.3,112.95 R17.2
  Top Layer w0.7: 13.78,117.15 22.54,117.15 23.18,116.52 23.18,113.21 22.72,112.75 R17.2 ; 13.78,117.15 14.67,116.26 14.67,113.42 R25.2 ; 13.78,117.15 9.46,117.15 7.6,115.29 R20.2 ; v1(4,16.06) 4,14.03 ; v1(2.98,26.34) 2.5,25.86 U5.2
  Top Layer w0.8: 14.41,60 12.91,61.5 C7.1 ; 17.59,23.93 18.93,23.93 USB1.1 ; 3,8.95 3,7.15 3.4,6.75 CN5.2 ; CN4.2 20.76,6.16 20.76,7.42 20.34,7.85 Q2.2
  Top Layer w1: v3(8.06,98.99) 8.06,98.1 7.43,97.47 ; C22.1 6.19,34.7 6.79,34.09 ; Q3.2 12.44,95.24 R11.2 ; U7.1 10.81,53.35 10.73,53.27 ; 18.82,7.85 17.38,6.41 12.89,6.41 11.49,7.8 4.14,7.8 3,8.95 3,9.72 4.13,10.85 4.13,13.9 1.59,16.44 1.59,17.9 1.65,17.84 4.46,17.84 C2.1
  CPU1 w0.5: v1(9.46,83.24) 12.25,83.24 v1(12.76,82.73)
  CPU2 w0.3: v2(6.67,87.69) 6.67,85.02 8.44,83.24 v1(9.46,83.24)
  Bottom Layer w0.5: 16.25,84.77 15.3,84.77 15.05,84.51 ; v1(4,16.06) 6.54,16.06 8.7,18.22 v1(8.7,23.68) ; CN4.2 20.6,3.45 20,2.85 R6.1 17.7,1.95 17.46,1.71 12.89,1.71 12.25,2.34 12.25,6.06 U1.9 ; v1(16.44,81.59) 13.91,81.59 v1(12.76,82.73) ; 18.5,10.6 18.6,10.7 v1(18.6,14.15) ; 10.63,90.86 12.63,90.86
  Bottom Layer w0.7: v1(2.98,26.34) 2.98,17.07 v1(4,16.06)
  Bottom Layer w0.8: 3.4,6.66 CN5.2 3.4,4.97 4.13,4.25 R5.1 ; 3.4,6.66 4.38,7.63 U1.3 10.78,7.63 U1.9 ; 3.4,6.66 3.4,9.24 4.25,10.09 5.71,10.09 C1.1
  Bottom Layer w1: U6.8 7.56,98.48 v3(8.06,98.99) ; 18.5,110.2 20.85,110.2 20.89,110.17
  vias: v2(1.08,109.28) v2(1.08,104.83) v2(1.08,15.04) v2(1.08,11.11) v2(2,1) v2(2.5,119) v2(4,1) v2(4.5,119) v2(11,119) v2(11,1) v2(13,119) v2(13,1) v2(15.3,24) v2(15.3,23) v2(19.5,119) v2(20,1) v2(21.5,119) v2(22,1) v2(22.92,15.17) v2(22.92,10.85) v2(23.05,109.15) v2(23.05,104.96)
VIN: length 14.4
  Top Layer w0.8: U5.4 1.55,19.34 1.59,19.3
  Top Layer w1: 6.2,17 C2.2 6.2,18.68 5.27,19.61 1.91,19.61 1.6,19.3 ; 6.2,17 6.75,17.55 Q1.2 ; 6.2,17 6.2,14.37 6.03,14.2
ADC_B: length 89.1
  Top Layer w0.3: U4.27 7.25,79.44 7.56,79.75 6.73,79.75 6.67,79.81 v2(6.67,83.5) ; v2(14.92,18.47) 15.88,18.47 R14.1
  Top Layer w0.5: R14.1 16.1,19.4 16.57,19.87 17.72,19.87 18.1,19.49 18.1,18.26 R16.2
  CPU2 w0.3: v2(6.67,83.5) 4.44,81.26 4.44,69.72 6.62,67.54 6.62,63.48 7.94,62.16 9.92,62.16 10.98,61.1 10.98,59.37 13.2,57.15 13.2,54.72 11.75,53.27 11.75,47.68 13.27,46.16 13.27,43.49 9.97,40.19 9.97,36.38 12.51,33.84 12.51,20.88 v2(14.92,18.47)
ADC_P: length 107.2
  Top Layer w0.3: U4.26 7.75,78.36 9.08,79.69 9.97,79.69 10.6,80.32 v2(10.6,84.77)
  CPU2 w0.3: v2(10.6,84.77) 10.6,82.48 10.22,82.1 6.67,82.1 4.89,80.32 4.89,70.03 7.2,67.72 7.2,63.66 8.19,62.67 10.21,62.67 11.49,61.39 11.49,59.62 13.91,57.21 13.91,54.54 12.25,52.89 12.25,47.94 13.91,46.28 13.91,42.86 10.48,39.43 10.48,36.63 13.4,33.71 13.4,21.9 14.67,20.63 17.72,20.63 19.75,18.6 19.75,9.96 22.1,7.61 CN4.3
AS01_CE: length 38.5
  Top Layer w0.3: v2(11.62,67.75) 11.25,67.38 U4.62
  Bottom Layer w0.3: 15.17,94.6 15.17,92.77 14.03,91.62 9.33,91.62 8.07,90.36 8.07,82.22 8.57,81.72 8.57,75.11 7.94,74.48 7.94,72.95 8.57,72.32 10.48,72.32 11.87,70.92 11.87,68 v2(11.62,67.75)
AS01_IRQ: length 33.5
  Top Layer w0.3: U4.61 10.75,67.47 v2(9.71,68.51)
  Bottom Layer w0.3: U6.7 8.82,92.39 6.03,89.6 6.03,71.43 7.3,70.16 9.08,70.16 9.71,69.53 v2(9.71,68.51)
BAT_CHRG: length 50.2
  Top Layer w0.3: U4.57 8.75,62.59 6.41,60.25 v2(4.38,60.25) ; v2(19.24,35.49) 19.24,35.11 19.75,34.6 19.75,33.81 19.95,33.6
  Top Layer w0.5: 19.95,33.6 19.97,33.58 21.27,33.58 22.2,32.66 R3.1
  CPU1 w0.3: v2(19.24,35.49) 19.24,38.41 17.46,40.19 12.25,40.19 8.57,43.87 8.57,46.28 1.71,53.14 1.71,57.59 v2(4.38,60.25)
BAT_DONE: length 96
  Top Layer w0.3: v2(0.82,68.51) 1.06,68.75 U4.45
  CPU1 w0.3: v2(7.56,2.98) 7.94,2.6 15.05,2.6 v2(15.43,2.98) ; v2(5.27,12.5) 7.68,12.5 12.44,17.26 12.44,28.58 6.41,34.6 6.41,43.36 5.27,44.51 5.27,47.94 0.81,52.4 0.81,59.86 1.33,60.38 1.33,68 v2(0.82,68.51)
  CPU2 w0.3: v2(5.27,12.5) 4.13,11.36 4.13,8.69 5.9,6.91 5.9,3.49 6.41,2.98 v2(7.56,2.98)
  Bottom Layer w0.3: R6.2 16.81,4.35 v2(15.43,2.98)
  Bottom Layer w0.5: R6.2 R1.1 17.49,6.25 16.1,7.63 U1.6
FLASH_CS: length 21.1
  Top Layer w0.3: U4.20 10.75,75.22 10.98,74.99 v2(12.25,74.99) ; v2(9.97,86.04) 12,86.04 v2(13.02,85.02)
  Bottom Layer w0.3: 10.63,87.05 9.21,87.05 8.95,86.8 8.95,86.29 9.21,86.04 v2(9.97,86.04) ; v2(13.02,85.02) 12.51,85.02 11.69,84.2 11.69,75.55 v2(12.25,74.99)
FLASH_MISO: length 24.1
  Top Layer w0.3: U4.22 9.75,74.31 v2(10.98,73.08) ; v2(9.84,84.38) 9.21,85.02 9.21,87.69 8.95,87.94 v2(8.95,89.08)
  Bottom Layer w0.3: v2(10.98,73.08) 10.73,73.08 9.8,74.01 9.8,81.55 10.6,82.35 10.6,83.75 9.97,84.38 v2(9.84,84.38) ; v2(8.95,89.08) 8.95,88.7 9.33,88.32 10.63,88.32
FLASH_MOSI: length 27.4
  Top Layer w0.3: v2(9.84,73.08) 9.25,73.67 U4.23
  Bottom Layer w0.3: 17.69,90.86 16.44,90.86 10.98,85.4 9.97,85.4 8.52,83.95 8.52,82.53 9.21,81.84 9.21,73.72 v2(9.84,73.08)
FLASH_SCK: length 24.2
  Top Layer w0.3: v2(11.75,74.35) 10.48,74.35 10.25,74.58 U4.21
  Bottom Layer w0.3: v2(11.75,74.35) 10.6,74.35 10.25,74.7 10.25,80.35 11.24,81.34 11.24,84.51 16.32,89.59 17.69,89.59
I2C1_SCL: length 13.7
  Top Layer w0.3: v2(3.49,57.97) 4.51,58.98 6.16,58.98 9.25,62.08 U4.58
  Bottom Layer w0.3: v2(3.49,57.97) 3.76,57.97 U7.3
I2C1_SDA: length 12.6
  Top Layer w0.3: U4.59 9.75,61.81 6.28,58.35 5.14,58.35 3.24,56.44 3.24,56.05 U7.4
KEY2: length 36.6
  Top Layer w0.3: 15.75,50.25 13.91,52.09 13.91,58.48 13.27,59.11 13.27,59.37 v2(13.02,59.62) ; 15.75,50.25 R21.1 ; 15.75,50.25 SW2.2 17.35,50.25 C14.2 20.65,50.25 SW2.1 ; U4.9 11.82,71.25 10.98,70.41 v2(10.98,68.89)
  Bottom Layer w0.3: v2(10.98,68.89) 10.86,68.76 10.86,67.11 10.22,66.48 10.22,62.41 v2(13.02,59.62)
KEY_ON: length 35.1
  Top Layer w0.3: v2(13.02,65.59) 13.02,66.48 12.25,67.24 12.25,68 11.62,68.64 11.62,69.91 12.46,70.75 U4.8 ; v2(10.98,63.43) 10.75,63.2 10.75,60.74 12.63,58.86 12.63,51.75 9.21,48.32 8.13,48.32 R9.1
  Top Layer w0.5: R9.1 6.16,46.6 6.16,45.27 6.54,44.89 7.44,44.89 Q4.3
  Bottom Layer w0.3: v2(13.02,65.59) 13.02,65.46 v2(10.98,63.43)
MOTOR: length 45.7
  Top Layer w0.3: v2(6.54,106.48) 6.5,106.45 R19.2 ; U4.34 4.86,74.25 7.3,71.81 v2(7.3,71.05)
  CPU1 w0.3: v2(7.3,71.05) 7.3,71.3 3.62,74.99 3.62,103.05 6.54,105.97 v2(6.54,106.48)
MRS_OUT: length 73
  Top Layer w0.3: v2(4.38,61.14) 6.41,61.14 8.25,62.98 U4.56
  CPU1 w0.3: v2(4.38,61.14) 4,61.14 1.26,58.4 1.26,52.83 5.9,48.19 5.9,44.63 10.73,39.81 10.73,31.3 12.89,29.14 12.89,16.69 9.08,12.88 9.08,9.33 8.06,8.31 5.78,8.31 4.89,7.42 4.89,6.01 CN5.3
MY_IO1: length 52.7
  Top Layer w0.3: v2(12.13,72.19) 12.57,71.75 U4.10
  CPU1 w0.3: U3.16 7.83,101.68 5.01,98.86 5.01,75.52 8.6,71.94 11.87,71.94 v2(12.13,72.19)
MY_IO2: length 49.5
  Top Layer w0.3: v2(11.87,72.95) 12.38,72.95 13.09,72.25 U4.11
  CPU1 w0.3: v2(11.87,72.95) 11.37,72.45 8.73,72.45 5.52,75.65 5.52,97.08 6.16,97.72 20.74,97.72 U3.15
MY_IO3: length 41.4
  Top Layer w0.3: U4.25 8.25,75.55 7.94,75.24 v2(6.79,75.24)
  CPU1 w0.3: U3.14 21.49,97.27 6.35,97.27 5.98,96.9 5.98,76.06 v2(6.79,75.24)
MY_IO4: length 43.5
  Top Layer w0.3: v2(8.57,74.22) 8.75,74.4 U4.24
  CPU1 w0.3: U3.13 19.4,96.81 6.9,96.81 6.54,96.45 6.54,92.77 7.27,92.03 7.27,82.95 6.43,82.1 6.43,78.78 8.82,76.38 8.82,74.48 v2(8.57,74.22)
MY_IO5: length 37.6
  Top Layer w0.3: v2(12.51,73.84) 12.51,73.94 12.82,74.25 U4.15
  CPU1 w0.3: U3.12 21.16,92.51 8.82,92.51 8.06,91.75 8.06,82.73 10.73,80.06 10.73,74.22 11.37,73.59 12.25,73.59 v2(12.51,73.84)
NRST: length 28.3
  Top Layer w0.254: SW3.2 17.92,60.13 v2(15.56,60.13)
  Top Layer w0.3: U4.7 12.85,70.25 12.51,69.91 v2(12.51,69.02) ; 18.15,59.9 18.15,53.3 ; SW3.2 15.9,57.65 C20.2
  Bottom Layer w0.3: v2(12.51,69.02) 12.51,67.37 13.91,65.97 13.91,61.78 v2(15.56,60.13) 15.56,57.8 R22.2
OSC32_IN: length 9.3
  Top Layer w0.3: 18.42,62.67 18.35,62.73 Y1.2 18.35,67.49 17.59,68.25 U4.3
OSC32_OUT: length 11.7
  Top Layer w0.3: 20.95,62.67 20.85,62.77 Y1.1 20.89,65.04 20.89,66.98 19.12,68.75 U4.4
OSC_IN: length 8.7
  Top Layer w0.3: U4.5 17.76,69.25 19,70.49 22.4,70.49 22.41,70.48
OSC_OUT: length 12.2
  Top Layer w0.3: U4.6 16.42,69.75 17.33,70.67 17.33,73.59 18.35,74.61 18.99,74.61 19.82,73.78 22.41,73.78
PWR_EN: length 28.1
  Top Layer w0.3: D3.2 4.51,42.51 v2(4.51,44.38) ; U4.55 7.75,63.24 6.67,62.16 4.13,62.16 1.46,59.49 v2(1.46,49.71)
  Bottom Layer w0.3: v2(1.46,49.71) 4.51,46.67 v2(4.51,44.38)
REDL: length 49.3
  Top Layer w0.3: v2(9.59,106.36) 8.39,106.36 R24.2 ; U4.35 4.35,73.75 5.27,72.83 5.27,72.07 7.11,70.23 7.63,70.23 v2(8.19,70.8)
  CPU1 w0.3: v2(9.59,106.36) 7.81,104.58 6.28,104.58 4.07,102.36 4.07,75.18 8.19,71.06 v2(8.19,70.8)
RX1: length 19
  Top Layer w0.3: U4.43 0.98,69.75 0.95,69.78
  CPU1 w0.3: 0.95,69.78 1.59,69.78 1.84,70.03 1.84,71.18 1.46,71.56 0.95,71.56
  CPU2 w0.3: U3.8 3.36,82.37 3.36,77.52 2.47,76.63 2.47,75.64 1.41,74.57 1.41,72.01 0.95,71.56
  vias: v2(0.8,71.5) v2(0.8,69.7)
RX6: length 30.4
  Top Layer w0.3: 0.82,72.45 1.02,72.25 U4.38
  CPU1 w0.3: 22.3,78.23 22.23,78.16 19.49,78.16 16.57,75.24 16.57,71.43 15.74,70.6 11.55,70.6 10.66,69.71 6.99,69.71 4.25,72.45 0.82,72.45
  vias: v2(0.8,72.4)
SOUNDCARD: length 17.2
  Top Layer w0.3: U4.29 6.25,78.58 5.4,79.44 5.4,88.07 7.05,89.72 10.09,89.72 R10.2
SPI3_CSN: length 43.1
  Top Layer w0.3: 5.25,65.7 5.25,67.51 v2(4.89,67.87)
  Bottom Layer w0.3: U6.3 13.91,92.64 13.34,92.08 9.15,92.08 6.54,89.47 6.54,89.08 7.43,88.19 7.43,82.35 6.67,81.59 6.67,79.05 7.43,78.29 7.43,72.7 8.32,71.81 9.71,71.81 10.32,71.2 10.32,68.23 9.59,67.49 5.27,67.49 v2(4.89,67.87)
SPI3_MISO: length 51.9
  Top Layer w0.3: v2(9.97,99.12) 10.98,100.13 v2(10.98,100.64) ; v2(8.44,68.51) 8.44,68.13 7.88,67.56 6.74,67.56 6.25,67.08 U4.52
  Bottom Layer w0.3: U6.6 9.97,94.73 v2(9.97,99.12) ; v2(8.44,68.51) 7.81,69.14 7.04,69.14 5.03,71.15 5.03,100.4 6.21,101.58 10.04,101.58 v2(10.98,100.64)
SPI3_MOSI: length 50.1
  Top Layer w0.3: U4.53 6.75,66.81 7.05,67.11 8.19,67.11 9.08,68 v2(9.08,69.02)
  Bottom Layer w0.3: U6.5 11.37,99.12 9.46,101.02 6.67,101.02 5.52,99.88 5.52,71.3 7.17,69.65 8.32,69.65 8.95,69.02 v2(9.08,69.02)
SPI3_SCK: length 54.1
  Top Layer w0.3: v2(7.56,68.38) 6.54,68.38 5.75,67.59 U4.51
  Bottom Layer w0.3: v2(7.56,68.38) 7.16,68.38 4.58,70.97 4.58,100.84 5.78,102.04 12.13,102.04 12.63,101.53 U6.4
SW_EN: length 31
  Top Layer w0.5: v1(7.3,20.63) 7.3,21.84 R26.2 ; 8.02,38.41 7.73,38.12 4.51,38.12 v1(4.51,40.44) ; v1(4.76,26.34) 3.45,25.03 U5.1
  Bottom Layer w0.5: v1(4.51,40.44) 4.76,40.19 v1(4.76,26.34) 4.76,23.17 v1(7.3,20.63)
SWCLK: length 43.5
  Top Layer w0.3: U4.49 4.75,63.67 v2(4.51,63.43)
  Bottom Layer w0.3: CN6.3 13.75,29.93 12.63,31.04 12.63,39.93 1.2,51.36 1.2,60.13 v2(4.51,63.43)
SWDIO: length 47.6
  Top Layer w0.3: U4.46 3.99,68.25 4.38,68.64 v2(4.38,68.89)
  Bottom Layer w0.3: CN6.2 14.51,32.47 13.4,33.58 13.4,39.93 1.71,51.62 1.71,59.62 5.14,63.05 5.14,63.81 4.76,64.19 3.75,64.19 3.49,64.45 3.49,68 v2(4.38,68.89)
TX1: length 21.4
  Top Layer w0.3: 0.95,70.67 1.08,70.67 1.5,70.25 U4.42
  CPU2 w0.3: 0.95,70.67 3.49,70.67 3.98,71.16 3.98,84.29 U3.7
  vias: v2(0.8,70.6)
TX6: length 31.6
  Top Layer w0.3: U4.37 1.41,72.75 0.82,73.34
  CPU1 w0.3: 0.82,73.34 4,73.34 7.17,70.16 10.35,70.16 11.24,71.05 15.56,71.05 16.12,71.61 16.12,75.43 21.42,80.73 22.3,80.73
  vias: v2(0.8,73.3)
USB+: length 65.2
  Top Layer w0.5: USB1.2 22.35,25.2 R2.2 ; USB1.5 21.69,28.8 22.16,29.27 22.16,29.91 R3.2
  Top Layer w0.8: D1.2 8.32,12.16 v1(8.32,15.17)
  Bottom Layer w0.5: R1.2 18.94,7.75 19.75,8.56 19.75,17.2
  Bottom Layer w0.8: C1.2 8.3,8.91 U1.4 ; v1(8.32,15.17) 9.59,16.44 12,16.44 ; USB1.2 19.99,25.2 21.27,23.92 21.27,28 20.47,28.8 USB1.5
  Bottom Layer w1: C1.2 7.2,11.64 12,16.44 18.98,16.44 21.27,18.72 21.27,23.92
UVL: length 53.1
  Top Layer w0.3: v2(9.08,71.05) 9.08,70.54 8.32,69.78 6.92,69.78 4.63,72.06 4.63,72.7 4.08,73.25 U4.36 ; R15.2 11.34,106.48 v2(12.63,106.48)
  CPU1 w0.3: v2(9.08,71.05) 8.77,71.36 8.54,71.36 4.52,75.37 4.52,101.8 6.67,103.94 10.09,103.94 v2(12.63,106.48)
$1N1304: length 6.1
  Top Layer w0.3: U4.30 5.75,78.44 4.76,79.43 4.76,80.07 4.38,80.45 C13.1
$1N1668: length 4.9
  Top Layer w0.3: U4.60 10.25,60.53 10.09,60.37
$1N1829: length 10.2
  Top Layer w0.3: U4.28 6.75,78.72 5.9,79.57 5.9,83.88 7.05,85.03 8.19,85.03
$1N9984: length 3.7
  Top Layer w0.5: Q7.3 9.35,113.35 CN9.2
$1N10713: length 7.8
  Top Layer w0.5: R25.1 13.8,111.05 Q7.1 10.09,111.05 8.3,109.26 R24.1
$1N11694: length 3.3
  Top Layer w0.5: Q6.3 2.38,112.78 2.38,114.97 CN7.2
$1N11697: length 7.2
  Top Layer w0.5: R19.1 5.45,108.1 Q6.1 7.04,111.05 7.56,111.56 7.56,113.2 R20.1
$1N15476: length 4.6
  Top Layer w0.8: L1.1 1.55,26.75 U5.3
$1N15617: length 16
  Top Layer w0.5: C19.2 8.44,26.24 8.44,25.33 7.94,24.82 ; 7.94,24.82 6.92,24.82 6.5,25.24 R23.1 5.65,25.4 5.65,21.39 5.27,21.01 4.21,21.01 U5.5 ; 7.94,24.82 10.22,24.82 10.5,25.1 R27.2
$1N23471: length 18.5
  Top Layer w0.5: Q4.1 11.8,44.05 R12.1 13.75,44.25 SW1.2 12.4,38.9 D2.2
  Top Layer w0.8: SW1.2 SW1.1
$1N28745: length 4.4
  Top Layer w0.5: R11.1 12.19,93.34 Q3.1 10.23,91.37 R10.1
$1N30076: length 6.2
  Top Layer w1: U3.4 7.69,94.06 Q3.3
$1N30362: length 20.6
  Top Layer w0.5: CN2.1 18.5,90.84 20.36,88.98 U3.11
$1N30425: length 24.1
  Top Layer w0.5: U3.10 22.14,86.42 20.25,86.42 16.5,90.17 CN2.2
$1N40650: length 2.9
  Bottom Layer w0.8: U1.2 7.61,6.37 R5.2
$1N44119: length 8.8
  Top Layer w1: 18,10.15 11.3,10.15 10.75,10.7 CN1.1
$1N77249: length 6.4
  Top Layer w0.5: R4.1 19.49,11.16 19.49,9.45 19.11,9.07 17.59,9.07 17.05,8.53 17.05,7.85
$1N80171: length 17
  Top Layer w0.5: Q1.1 9.17,19.45 9.97,20.25 10.73,20.25 11.2,20.72 11.2,21.53 11.21,21.52 21.14,21.52 22.41,22.79 22.41,23.73 R2.1
$1N140145: length 11.6
  Top Layer w0.5: R17.1 21.3,111.05 Q5.1 19.23,110.93 16.83,110.93 13.91,108.01 11.35,108.01 R15.1
$1N144140: length 4.9
  Top Layer w0.5: CN3.2 18.23,115 17.08,113.85 17.08,112.03 Q5.3

## Copper pours and planes (outline as drawn; the poured copper is in the pictures)
GND on Top Layer: -2.22,122.36 25.46,122.36 25.46,-1.85 -2.22,-1.85
GND on Bottom Layer: -2.22,122.36 25.46,122.36 25.46,-1.85 -2.22,-1.85
